# Altium project ADCS.PrjPcb (part 2 of 2)
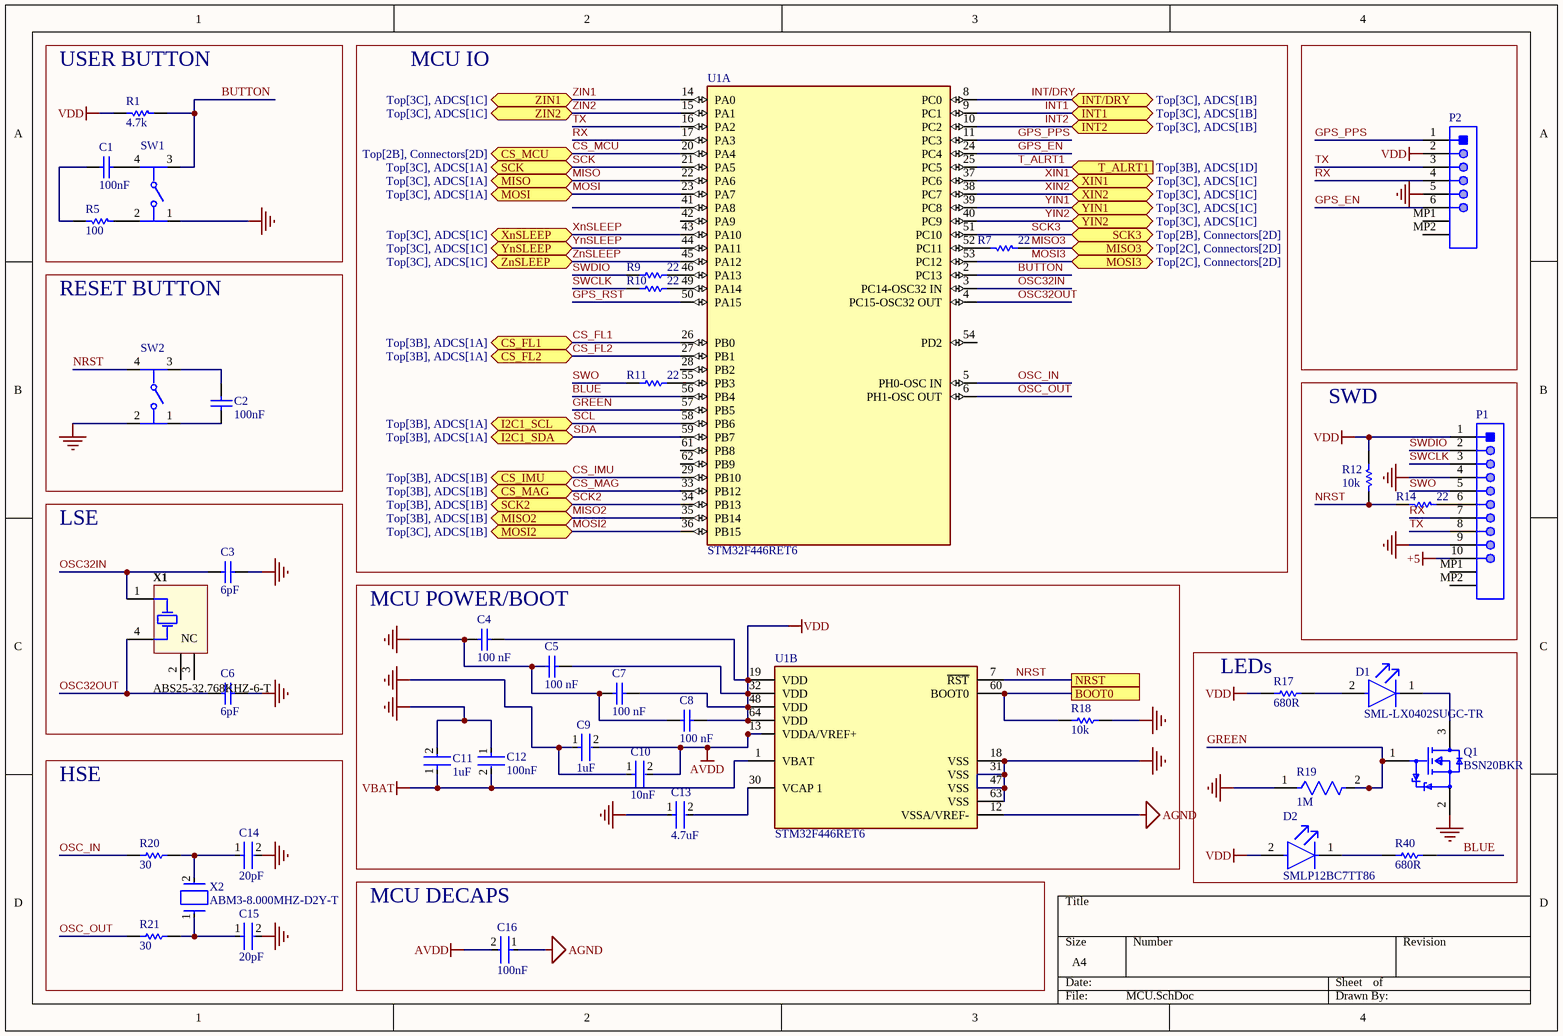
[diagram p5: MCU.SchDoc]

## Nets that join several sheets
+5: ADCS (8 pins), Connectors (6 pins), MCU (P1.10)
AGND: Connectors (J10.32), MCU (C16.1 U1.12)
GND: ADCS (29 pins), Connectors (11 pins), MCU (25 pins)
VBAT: Connectors (J9.33), MCU (C11.1 C12.2 U1.1)
VDD: ADCS (34 pins), Connectors (C33.1 R43.2 U12.5), MCU (14 pins)
BOOT0: Connectors (J9.9), MCU (R18.2 U1.60)
CS_FL1: ADCS (R26.2 U3.1), MCU (U1.26)
CS_FL2: ADCS (R27.2 U4.1), MCU (U1.27)
CS_IMU: ADCS (R6.1 U10.12), MCU (U1.29)
CS_MAG: ADCS (U7.3), MCU (U1.33)
CS_MCU: Connectors (J10.22 R43.1), MCU (U1.20)
INT1: ADCS (U10.4), MCU (U1.9)
INT2: ADCS (U10.9), MCU (U1.10)
INT/DRY: ADCS (R30.2), MCU (U1.8)
MISO: ADCS (U3.2 U4.2), MCU (U1.22)
MISO2: ADCS (R31.2 U10.1), MCU (U1.35)
MISO3: Connectors (J10.27), MCU (R7.1)
MOSI: ADCS (U3.5 U4.5), MCU (U1.23)
MOSI2: ADCS (R37.2 U10.2), MCU (U1.36)
MOSI3: Connectors (J10.29), MCU (U1.53)
NRST: Connectors (J9.16), MCU (R12.2 R14.2 SW2.4 U1.7)
SCK: ADCS (U3.6 U4.6), MCU (U1.21)
SCK2: ADCS (R39.2 U10.3), MCU (U1.34)
SCK3: Connectors (J10.31), MCU (U1.51)
SCL: ADCS (5 pins), MCU (U1.58)
SDA: ADCS (5 pins), MCU (U1.59)
T_ALRT1: ADCS (U11.3), MCU (U1.25)
XIN1: ADCS (U2.6), MCU (U1.37)
XIN2: ADCS (U2.5), MCU (U1.38)
XnSLEEP: ADCS (U2.7), MCU (U1.43)
YIN1: ADCS (U5.6), MCU (U1.39)
YIN2: ADCS (U5.5), MCU (U1.40)
YnSLEEP: ADCS (U5.7), MCU (U1.44)
ZIN1: ADCS (U6.6 U8.6), MCU (U1.14)
ZIN2: ADCS (U6.5 U8.5), MCU (U1.15)
ZnSLEEP: ADCS (U6.7 U8.7), MCU (U1.45)